# Altium schematic sheet AirTHD.SchDoc
size A3; SheetNumber: 1; SheetTotal: 1
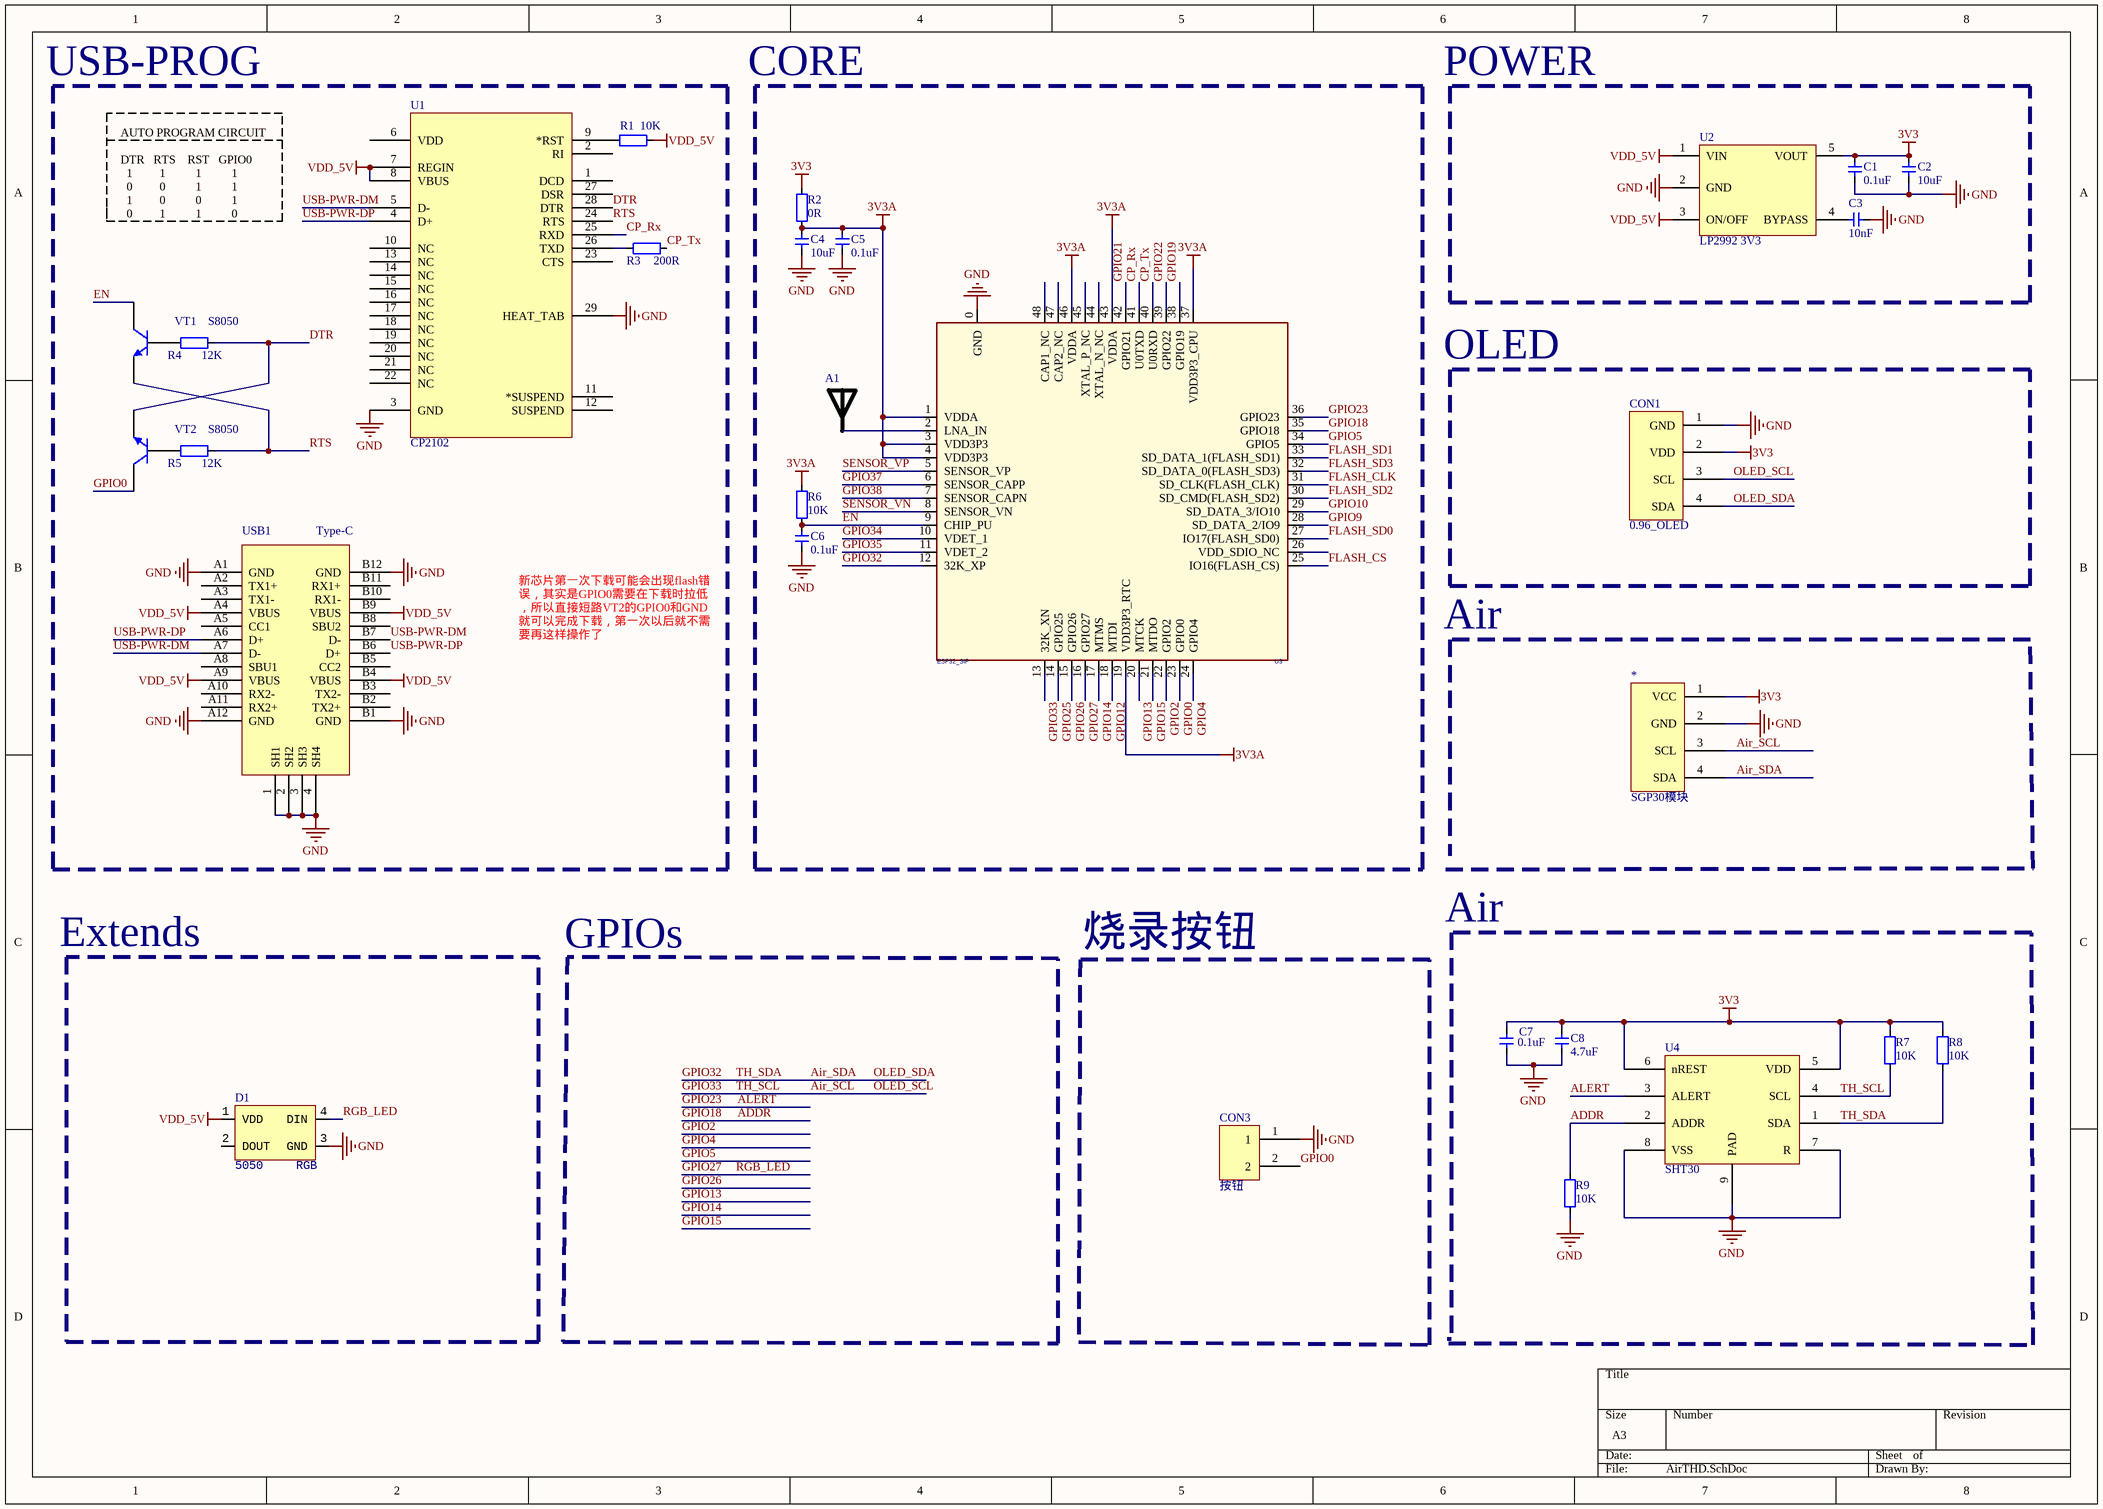
[diagram p0: AirTHD.SchDoc]

## Parts
*  SGP30模块  [4Pin排针]
A1  RAINSUN  [ANT-Rainsun-AN5120]  (value not drawn)
C1  0.1uF  [CAP_0402]
C2  10uF  [CAP_0402]
C3  10nF  [CAP_0402]
C4  10uF  [CAP_0402]
C5  0.1uF  [CAP_0402]
C6  0.1uF  [CAP_0402]
C7  0.1uF  [CAP_0402]
C8  4.7uF  [CAP_0402]
CON1  0.96_OLED  [4Pin排针]
CON3  按钮  [3*4贴片按钮]
D1  Type: 5050  [LED_5050_WS2812B]  (hidden comment: RGB)
R1  10K  [RES_0402]
R2  0R  [RES_0402]
R3  200R  [RES_0402]
R4  12K  [RES_0402]
R5  12K  [RES_0402]
R6  10K  [RES_0402]
R7  10K  [RES_0402]
R8  10K  [RES_0402]
R9  10K  [RES_0402]
U1  CP2102  [QFN-28]
U2  LP2992 3V3  [SOT23-5]
U3  ESP32_SIP  [QFN-48_7X7]
U4  SHT30  [SHT30]
USB1  Type-C  [Type-C-TOP]
VT1  S8050  [SMT_TRIODE_NPN]
VT2  S8050  [SMT_TRIODE_NPN]

## Blocks framed on the sheet
烧录按钮: CON3

## Nets
3V3: *.1(VCC) C1.2 C2.2 C7.2 C8.2 CON1.2(VDD) R2.1 R7.2 R8.2 U2.5(VOUT) U4.5(VDD) U4.6(nREST)
3V3A: C4.2 C5.2 R2.2 R6.1 U3.1(VDDA) U3.3(VDD3P3) U3.4(VDD3P3) U3.19(VDD3P3_RTC) U3.37(VDD3P3_CPU) U3.43(VDDA) U3.46(VDDA)
GND: *.2(GND) C1.1 C2.1 C3.1 C4.1 C5.1 C6.2 C7.1 C8.1 CON1.1(GND) CON3.1 D1.3(GND) R9.1 U1.3(GND) U1.29(HEAT_TAB) U2.2(GND) U3.0(GND) U4.7(R) U4.8(VSS) U4.9(PAD) USB1.1(SH1) USB1.2(SH2) USB1.3(SH3) USB1.4(SH4) USB1.A1(GND) USB1.A12(GND) USB1.B1(GND) USB1.B12(GND)
VDD_5V: D1.1(VDD) R1.1 U1.7(REGIN) U1.8(VBUS) U2.1(VIN) U2.3(ON/OFF) USB1.A4(VBUS) USB1.A9(VBUS) USB1.B4(VBUS) USB1.B9(VBUS)
ADDR: R9.2 U3.35(GPIO18) U4.2(ADDR)  [also labelled GPIO18]
Air_SCL: *.3(SCL) CON1.3(SCL) R7.1 U3.13(32K_XN) U4.4(SCL)  [also labelled GPIO33, OLED_SCL, TH_SCL]
Air_SDA: *.4(SDA) CON1.4(SDA) R8.1 U3.12(32K_XP) U4.1(SDA)  [also labelled GPIO32, OLED_SDA, TH_SDA]
ALERT: U3.36(GPIO23) U4.3(ALERT)  [also labelled GPIO23]
CP_Rx: U1.25(RXD) U3.41(U0TXD)
CP_Tx: R3.1 U3.40(U0RXD)
DTR: R4.1 U1.28(DTR) VT2.2(E)
EN: C6.1 R6.2 U3.9(CHIP_PU) VT1.3(C)
FLASH_CLK: U3.31(SD_CLK(FLASH_CLK))
FLASH_CS: U3.25(IO16(FLASH_CS))
FLASH_SD0: U3.27(IO17(FLASH_SD0))
FLASH_SD1: U3.33(SD_DATA_1(FLASH_SD1))
FLASH_SD2: U3.30(SD_CMD(FLASH_SD2))
FLASH_SD3: U3.32(SD_DATA_0(FLASH_SD3))
GPIO0: CON3.2 U3.23(GPIO0) VT2.3(C)
GPIO2: U3.22(GPIO2)
GPIO4: U3.24(GPIO4)
GPIO5: U3.34(GPIO5)
GPIO9: U3.28(SD_DATA_2/IO9)
GPIO10: U3.29(SD_DATA_3/IO10)
GPIO12: U3.18(MTDI)
GPIO13: U3.20(MTCK)
GPIO14: U3.17(MTMS)
GPIO15: U3.21(MTDO)
GPIO19: U3.38(GPIO19)
GPIO21: U3.42(GPIO21)
GPIO22: U3.39(GPIO22)
GPIO25: U3.14(GPIO25)
GPIO26: U3.15(GPIO26)
GPIO27: D1.4(DIN) U3.16(GPIO27)  [also labelled RGB_LED]
GPIO34: U3.10(VDET_1)
GPIO35: U3.11(VDET_2)
GPIO37: U3.6(SENSOR_CAPP)
GPIO38: U3.7(SENSOR_CAPN)
RTS: R5.1 U1.24(RTS) VT1.2(E)
SENSOR_VN: U3.8(SENSOR_VN)
SENSOR_VP: U3.5(SENSOR_VP)
USB-PWR-DM: U1.5(D-) USB1.A7(D-) USB1.B7(D-)
USB-PWR-DP: U1.4(D+) USB1.A6(D+) USB1.B6(D+)
NetA1_1: A1.1 U3.2(LNA_IN)
NetC3_2: C3.2 U2.4(BYPASS)
NetR1_2: R1.2 U1.9(*RST)
NetR3_2: R3.2 U1.26(TXD)
NetR4_2: R4.2 VT1.1(B)
NetR5_2: R5.2 VT2.1(B)

Not connected (* = marked no-connect by the designer): D1 2(DOUT); U1 1(DCD) 2(RI) 6(VDD) 10(NC) 11(*SUSPEND) 12(SUSPEND) 13(NC) 14(NC) 15(NC) 16(NC) 17(NC) 18(NC) 19(NC) 20(NC) 21(NC) 22(NC) 23(CTS) 27(DSR); U3 26(VDD_SDIO_NC) 44(XTAL_N_NC) 45(XTAL_P_NC) 47(CAP2_NC) 48(CAP1_NC); USB1 A2(TX1+) A3(TX1-) A5(CC1) A8(SBU1) A10(RX2-) A11(RX2+) B2(TX2+) B3(TX2-) B5(CC2) B8(SBU2) B10(RX1-) B11(RX1+)

## Notes on the sheet
- USB-PROG
- CORE
- POWER
- AUTO PROGRAM CIRCUIT
  DTR   RTS    RST   GPIO0
  1         1          1          1
  0         0          1          1
  1         0          0          1
  0         1          1          0
- OLED
- Air
- 新芯片第一次下载可能会出现flash错误，其实是GPIO0需要在下载时拉低，所以直接短路VT2的GPIO0和GND就可以完成下载，第一次以后就不需要再这样操作了
- Extends
- GPIOs

## Library data of the parts
A1 = ANT-Rainsun-AP5120
C1-C8 = 电容-0402: Capacitor; Value: 0.1u
D1 = LED_5050_WS2812B: LED; Value: RGB
R1-R9 = 电阻-0402: Resistor; Value: 22R
U1 = CP2102: USB转TTL; PART DESC: SINGLE-CHIP USB TO UART BRIDGE, QFN28, RoHS.; MFG #1: SILICON LABS; PART NUMBER: CP2102; Value: Value; RefDes: RefDes; Type: DEV
U2 = LP2992: LDO
U3 = ESP32-PICO
USB1 = USB-Type-C-TOP
VT1 VT2 = SMT_TRIODE_NPN: Surface mount NPN transistor, package SOT-23